# Altium schematic sheet STM32.SchDoc
size A3 portrait; Organization: Altium Limited; Address1: L3, 12a Rodborough Rd; Address2: Frenchs Forest; Address3: NSW; Address4: Australia 2086
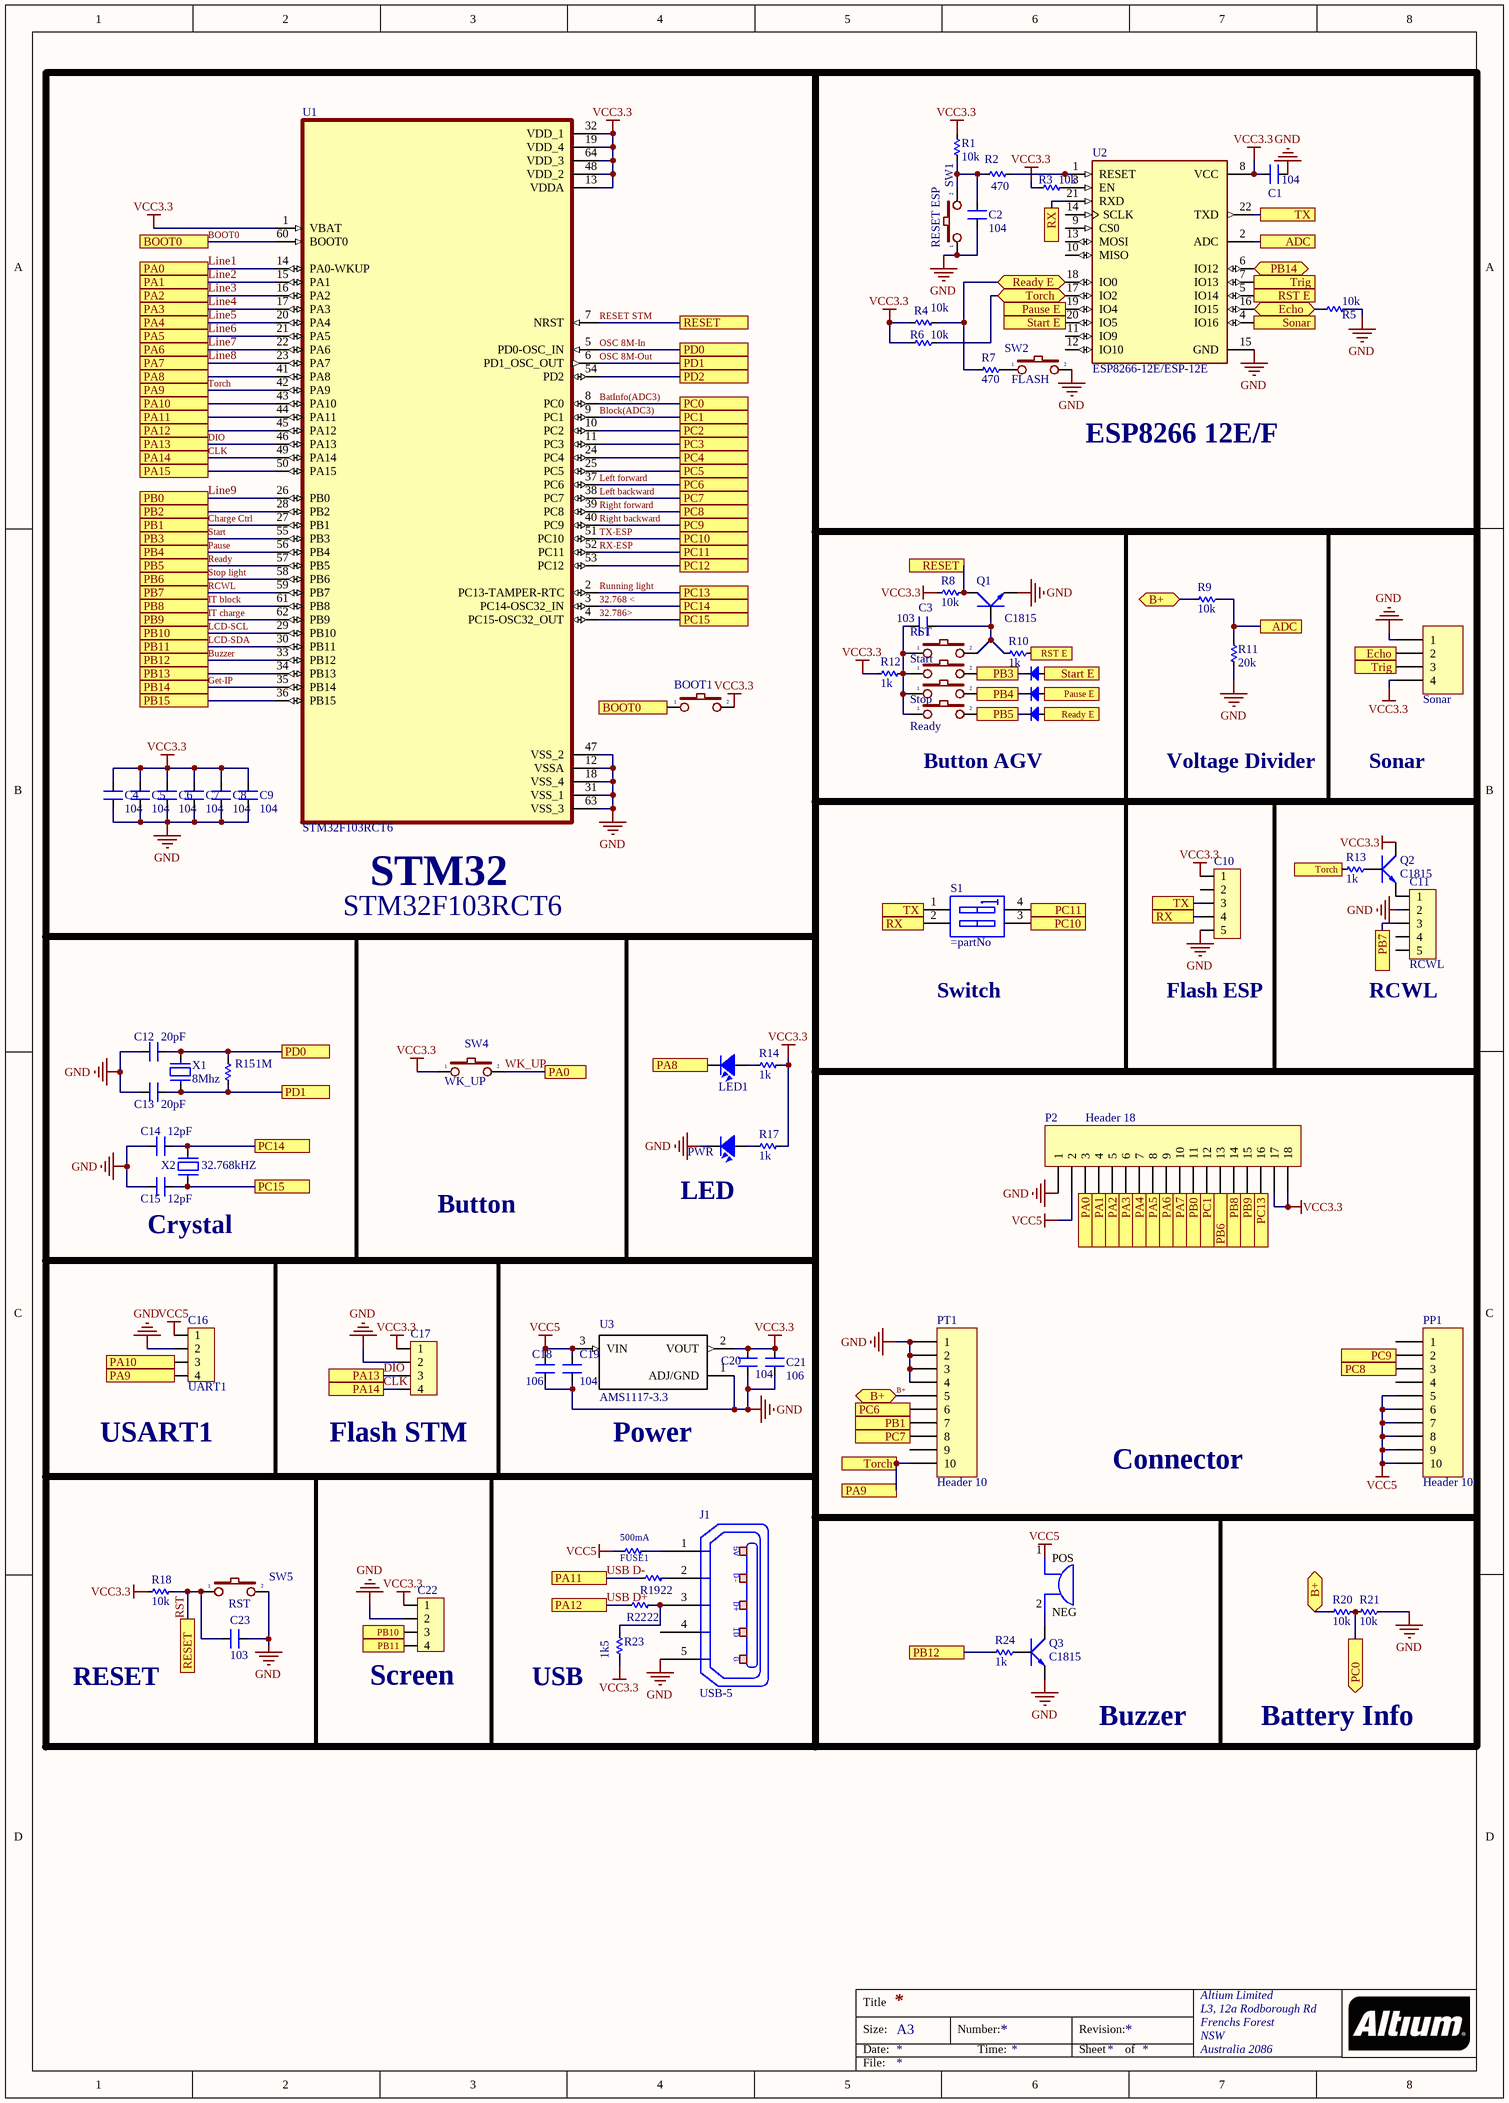
[diagram p0: STM32.SchDoc]

## Parts
BOOT1  SW  [SW-DIP1-1]  (value not drawn)
C1  104  [SM-CAP-0805]
C2  104  [SM-CAP-0805]
C3  103  [SM-CAP-0805]
C4  104  [SM-CAP-0805]
C5  104  [SM-CAP-0805]
C6  104  [SM-CAP-0805]
C7  104  [SM-CAP-0805]
C8  104  [SM-CAP-0805]
C9  104  [SM-CAP-0805]
C10  Flash ESP  [HDR5]
C11  RCWL  [HDR5]
C12  20pF  [SM-CAP-0805]
C13  20pF  [SM-CAP-0805]
C14  12pF  [SM-CAP-0805]
C15  12pF  [SM-CAP-0805]
C16  UART1  [HDR4]
C17  Flash STM  [HDR4]
C18  106  [SM-CAP-0805]
C19  104  [SM-CAP-0805]
C20  104  [SM-CAP-0805]
C21  106  [SM-CAP-0805]
C22  Screen  [HDR4]
C23  103  [SM-CAP-0805]
DIO1  Diode SMD  [DIO-SMD-106]  (value not drawn)
DIO2  Diode SMD  [DIO-SMD-106]  (value not drawn)
DIO3  Diode SMD  [DIO-SMD-106]  (value not drawn)
FUSE1  500mA  [RES-SMD-0805]
J1  USB-5  [USB-M1]
LED1  DS0  [LED-0805-Blue]  (value not drawn)
LED3  PWR  [LED-0805-Blue]
LS1  MCKPM-G1201A-K4037  [XDCR_MCKPM-G1201A-K4037]  (value not drawn)
P1  Sonar  [HDR1X4]
P2  Header 18  [HDR1X18]
PP1  Header 10  [HDR1X10]
PT1  Header 10  [HDR1X10]
Q1  C1815  [SOT23B]
Q2  C1815  [SOT23B]
Q3  C1815  [SOT23B]
R1  10k  [RES-SMD-0805]
R2  470  [RES-SMD-0805]
R3  10k  [RES-SMD-0805]
R4  10k  [RES-SMD-0805]
R5  10k  [RES-SMD-0805]
R6  10k  [RES-SMD-0805]
R7  470  [RES-SMD-0805]
R8  10k  [RES-SMD-0805]
R9  10k  [RES-SMD-0805]
R10  1k  [RES-SMD-0805]
R11  20k  [RES-SMD-0805]
R12  1k  [RES-SMD-0805]
R13  1k  [RES-SMD-0805]
R14  1k  [RES-SMD-0805]
R15  1M  [RES-SMD-0805]
R17  1k  [RES-SMD-0805]
R18  10k  [RES-SMD-0805]
R19  22  [RES-SMD-0805]
R20  10k  [RES-SMD-0805]
R21  10k  [RES-SMD-0805]
R22  22  [RES-SMD-0805]
R23  1k5  [RES-SMD-0805]
R24  1k  [RES-SMD-0805]
RST1  RST  [SW1-SMD]
S1  (no value)  [SW-DIP2]
Start1  Start  [SW1-SMD]
Stop1  Stop  [SW1-SMD]
SW1  RESET ESP  [SW1-SMD]
SW2  FLASH  [SW1-SMD]
SW3  Ready  [SW1-SMD]
SW4  WK_UP  [SW1-SMD]
SW5  RST  [SW1-SMD]
U1  STM32F103RCT6  [QFP50P1200X1200X160-64N]
U2  ESP8266-12E/ESP-12E  [XCVR_ESP8266-12E/ESP-12E]
U3  AMS1117-3.3  [*SOT229P700X180-4N]
X1  8Mhz  [XT2]
X2  32.768kHZ  [XT32k]

## Ports
ADC, B+ (bidir), BOOT0, Echo, Echo (bidir), PA0, PA0 (out), PA1, PA1 (out), PA2, PA2 (out), PA3, PA3 (out), PA4, PA4 (out), PA5, PA5 (out), PA6, PA6 (out), PA7, PA7 (out), PA8, PA9, PA10, PA11, PA12, PA13, PA14, PA15, Pause E, PB0, PB0 (out), PB1, PB1 (in), PB2, PB3, PB4, PB5, PB6, PB6 (in), PB7, PB8, PB8 (out), PB9, PB9 (out), PB10, PB11, PB12, PB13, PB14, PB14 (bidir), PB15, PC0, PC0 (out), PC1, PC2, PC3, PC4, PC5, PC6, PC7, PC8, PC9, PC10, PC11, PC12, PC13, PC13 (in), PC14, PC15, PD0, PD1, PD2, Ready E, Ready E (bidir), RESET, RST E, RX, Sonar, Start E, Torch, Torch (bidir), Torch (in), Trig, TX

## Nets
GND: C1.1 C2.1 C4.1 C5.1 C6.1 C7.1 C8.1 C9.1 C10.5 C11.2 C12.1 C13.1 C14.1 C15.1 C16.2 C17.2 C18.1 C19.1 C20.1 C21.1 C22.2 C23.1 J1.5(P5) LED3.2 P1.1 P2.1 PT1.1 PT1.2 PT1.3 PT1.4 Q1.1(E) Q3.1(E) R5.2 R11.2 R21.1 SW1.1 SW2.2 SW5.2 U1.12(VSSA) U1.18(VSS_4) U1.31(VSS_1) U1.47(VSS_2) U1.63(VSS_3) U2.15(GND) U3.1(ADJ/GND)
VCC3.3: BOOT1.2 C1.2 C4.2 C5.2 C6.2 C7.2 C8.2 C9.2 C10.1 C17.1 C20.2 C21.2 C22.1 P1.4 P2.17 P2.18 Q2.2(C) R1.1 R3.1 R4.1 R6.1 R8.1 R12.2 R14.1 R17.1 R18.2 R23.1 SW4.1 U1.1(VBAT) U1.13(VDDA) U1.19(VDD_4) U1.32(VDD_1) U1.48(VDD_2) U1.64(VDD_3) U2.8(VCC) U3.2(VOUT)
VCC5: C16.1 C18.2 C19.2 FUSE1.1 LS1.1(POS) P2.2 PP1.5 PP1.6 PP1.7 PP1.8 PP1.9 PP1.10 U3.3(VIN)
32.768 <: C14.2 U1.3(PC14-OSC32_IN) X2.2 ; port PC14
32.786>: C15.2 U1.4(PC15-OSC32_OUT) X2.1 ; port PC15
ADC: R9.2 R11.1 U2.2(ADC) ; port ADC
B+: PT1.5 R9.1 R20.2 ; port B+
BatInfo(ADC3): R20.1 R21.2 U1.8(PC0) ; port PC0
Block(ADC3): P2.12 U1.9(PC1) ; port PC1
BOOT0: BOOT1.1 U1.60(BOOT0) ; port BOOT0
Buzzer: R24.2 U1.33(PB12) ; port PB12
Charge Ctrl: PT1.7 U1.27(PB1) ; port PB1
CLK: C17.4 U1.49(PA14) ; port PA14
DIO: C17.3 U1.46(PA13) ; port PA13
Echo: P1.2 R5.1 U2.16(IO15) ; port Echo
Get-IP: U1.35(PB14) U2.6(IO12) ; port PB14
IT block: P2.14 U1.61(PB8) ; port PB8
IT charge: P2.15 U1.62(PB9) ; port PB9
LCD-SCL: C22.3 U1.29(PB10) ; port PB10
LCD-SDA: C22.4 U1.30(PB11) ; port PB11
Left backward: PT1.8 U1.38(PC7) ; port PC7
Left forward: PT1.6 U1.37(PC6) ; port PC6
Line1: P2.3 SW4.2 U1.14(PA0-WKUP) ; port PA0  [also labelled WK_UP]
Line2: P2.4 U1.15(PA1) ; port PA1
Line3: P2.5 U1.16(PA2) ; port PA2
Line4: P2.6 U1.17(PA3) ; port PA3
Line5: P2.7 U1.20(PA4) ; port PA4
Line6: P2.8 U1.21(PA5) ; port PA5
Line7: P2.9 U1.22(PA6) ; port PA6
Line8: P2.10 U1.23(PA7) ; port PA7
Line9: P2.11 U1.26(PB0) ; port PB0
OSC 8M-In: C12.2 R15.1 U1.5(PD0-OSC_IN) X1.1 ; port PD0
OSC 8M-Out: C13.2 R15.2 U1.6(PD1_OSC_OUT) X1.2 ; port PD1
PA8: LED1.2 U1.41(PA8) ; port PA8
PA10: C16.3 U1.43(PA10) ; port PA10
PA15: U1.50(PA15) ; port PA15
Pause: DIO2.2(K) Stop1.2 U1.56(PB4) ; port PB4
Pause E: DIO2.1(A) U2.19(IO4) ; port Pause E
PB2: U1.28(PB2) ; port PB2
PB13: U1.34(PB13) ; port PB13
PB15: U1.36(PB15) ; port PB15
PC2: U1.10(PC2) ; port PC2
PC3: U1.11(PC3) ; port PC3
PC4: U1.24(PC4) ; port PC4
PC5: U1.25(PC5) ; port PC5
PC12: U1.53(PC12) ; port PC12
PD2: U1.54(PD2) ; port PD2
RCWL: C11.3 U1.59(PB7) ; port PB7
Ready: DIO3.2(K) SW3.2 U1.57(PB5) ; port PB5
Ready E: DIO3.1(A) R4.2 R7.2 U2.18(IO0) ; port Ready E
RESET STM: C23.2 Q1.2(C) R8.2 R18.1 SW5.1 U1.7(NRST) ; port RESET  [also labelled RST]
Right backward: PP1.2 U1.40(PC9) ; port PC9
Right forward: PP1.3 U1.39(PC8) ; port PC8
RST E: R10.1 U2.5(IO14) ; port RST E
Running light: P2.16 U1.2(PC13-TAMPER-RTC) ; port PC13
RX: C10.4 S1.2 U2.21(RXD) ; port RX
RX-ESP: S1.4 U1.52(PC11) ; port PC11
Sonar: U2.4(IO16) ; port Sonar
Start: DIO1.2(K) Start1.2 U1.55(PB3) ; port PB3
Start E: DIO1.1(A) U2.20(IO5) ; port Start E
Stop light: P2.13 U1.58(PB6) ; port PB6
Torch: C16.4 PT1.10 R6.2 R13.1 U1.42(PA9) U2.17(IO2) ; port PA9, port Torch
Trig: P1.3 U2.7(IO13) ; port Trig
TX: C10.3 S1.1 U2.22(TXD) ; port TX
TX-ESP: S1.3 U1.51(PC10) ; port PC10
USB D+: R22.1 U1.45(PA12) ; port PA12
USB D-: R19.1 U1.44(PA11) ; port PA11
NetC2_2: C2.2 R1.2 R2.2 SW1.2
NetC3_1: C3.1 Q1.3(B) R10.2 RST1.2
NetC3_2: C3.2 R12.1 RST1.1 Start1.1 Stop1.1 SW3.1
NetC11_1: C11.1 Q2.1(E)
NetFUSE1_2: FUSE1.2 J1.1(P1)
NetJ1_2: J1.2(P2) R19.2
NetJ1_3: J1.3(P3) R22.2 R23.2
NetLED1_1: LED1.1 R14.2
NetLED3_1: LED3.1 R17.2
NetLS1_2: LS1.2(NEG) Q3.2(C)
NetQ2_3: Q2.3(B) R13.2
NetQ3_3: Q3.3(B) R24.1
NetR2_1: R2.1 U2.1(RESET)
NetR3_2: R3.2 U2.3(EN)
NetR7_1: R7.1 SW2.1

Not connected (* = marked no-connect by the designer): C10 2; C11 4 5; J1 4(P4); PP1 1 4; PT1 9; U2 9(CS0) 10(MISO) 11(IO9) 12(IO10) 13(MOSI) 14(SCLK)

## Notes on the sheet
- ESP8266 12E/F
- Button AGV
- Voltage Divider
- Sonar
- (near U1) STM32
- STM32F103RCT6
- Switch
- (near C11) RCWL
- Crystal
- Button
- LED
- (near C16) USART1
- Power
- Connector
- RESET
- (near R23) USB
- Buzzer
- Battery Info
- Title
- Size:
- Date:
- A3
- Number:
- Time:
- Revision:
- Sheet
- of
- File:
- (in symbol USB-5) 5V; D-; D+; ID; G

## Library data of the parts
BOOT1 RST1 Start1 Stop1 SW1-SW5 = SW2: Switch button 2 pin; Value: SW chip 2 pin
C1-C9 C12-C15 C18-C21 C23 = CN: Value: 0,1uF/300V; Designed by: VanDungEvn
C10 C11 = Header5: Header IDC, 5 x 1 Pin Vertical 2.54mm Pitch (Non-Boxed, Male); Manufacturer: W¨¹rth Elektronik eiSos GmbH; partNo: 613002143121; ComponentLink1 Description: Manufacturer; ComponentLink2 Description: Datasheet; NoPins: 02; Created Date: 29 March 2013; ComponentLink1URL: http://www.we-online.com; ComponentLink2URL: http://katalog.we-online.de/em/datasheet/6130xx143121.pdf; Created by: Karrer Zheng
C16 C17 C22 = Header4: Header IDC, 4 x 1 Pin Vertical 2.54mm Pitch (Non-Boxed, Male); Manufacturer: W¨¹rth Elektronik eiSos GmbH; partNo: 613002143121; ComponentLink1 Description: Manufacturer; ComponentLink2 Description: Datasheet; NoPins: 02; Created Date: 29 March 2013; ComponentLink1URL: http://www.we-online.com; ComponentLink2URL: http://katalog.we-online.de/em/datasheet/6130xx143121.pdf; Created by: Karrer Zheng
DIO1-DIO3 = Diode SMD: Default Diode; Code - JEDEC: DO-214-AB; Value: 1N5007; Published: 8-Jun-2000; Revision: July-2002: Re-released for DXP Platform.; Publisher: Altium Limited
FUSE1 R1-R15 R17-R24 = Res-SMD: Resistor; Manufacturer: Generic Components; Class: Passive; Published: 08/06/2000; Publisher: Altium Hobart Technology Centre
J1 = USB-5: Manufacturer: FCI; Manufacturer Part Number: 10118193-0001LF; Connector Type: USB - micro B; Number of Contacts: 5; Gender: Receptacle; Specifications: USB 2.0; .Creator: MM; .Checked PCB: RF; Supplier 1: Digi-Key; RoHS: RoHS Compliant; Category: Connectors, Interconnects; Stock 1: 28642; Pricing 1: 1=0.46, 10=0.433, 25=0.3712, 50=0.3156, 100=0.3032, 250=0.27224, 500=0.25988 (USD); Packaging: Cut Tape (CT); Mounting Type: Surface Mount, Right Angle, Horizontal; Features: Shielded, Solder Retention; Ingress Protection: -; ComponentLink1URL: http://portal.fciconnect.com/Comergent//fci/drawing/10118193.pdf; ComponentLink1Description: http://portal.fciconnect.com/Comergent//fci/drawing/10118193.pdf; Supplier Part Number 1: 609-4616-1-ND; .Checked SCH: MM
LED1 LED3 = LED SMD: Value: LED 3 - 5 ly 2 Colour
LS1 = MCKPM-G1201A-K4037: Zumbador y transductor magnÃ©ticos; MF: Multicomp; Value: *; SnapEDA_Link: https://www.snapeda.com/parts/MCKPM-G1201A-K4037/Multicomp/view-part/231709/?ref=snap; Package: None; MP: MCKPM-G1201A-K4037; Availability: Unavailable; Price: None
P1 = Header 4: Header, 4-Pin; LatestRevisionDate: 17-Jul-2002; LatestRevisionNote: Re-released for DXP Platform.; Publisher: Altium Limited
P2 = Header 18: Header, 18-Pin; LatestRevisionDate: 17-Jul-2002; LatestRevisionNote: Re-released for DXP Platform.; Publisher: Altium Limited
PP1 PT1 = Header 10: Header, 10-Pin; LatestRevisionDate: 17-Jul-2002; LatestRevisionNote: Re-released for DXP Platform.; Publisher: Altium Limited
Q1-Q3 = C1815: NPN 600mW, ECB; Value: C1815
S1 = SWDIP2: WS-DITV 2.54 mm small compact THT flat actuator with top tape; Manufacturer: Wurth Elektronik; Part No.: 418127160902; ComponentLink1 Description: Manufacturer; ComponentLink2 Description: Datasheet; Pole: 02; Created Date: Dec.2015; ComponentLink1URL: http://www.we-online.com; ComponentLink2URL: http://katalog.we-online.de/em/datasheet/4181271609xx.pdf; Created by: Baojun Chen
U1 = STM32F103RCT6: ARMÂ® CortexÂ®-M3 STM32F1 Microcontroller IC 32-Bit 72MHz 256KB _256K x 8_ FLASH; MF: STMicroelectronics; MP: STM32F103RCT6; Price: None; Package: LQFP-64 STMicroelectronics; Availability: Unavailable; SnapEDA_Link: https://www.snapeda.com/parts/STM32F103RCT6/STMicroelectronics/view-part/44152/?ref=snap; Value: *
U2 = ESP8266-12E/ESP-12E: This WiFi module has a 32-bit MCU micro and clock speeds supporting 80 MHz or 160 MHz. Supports the RTOS and integrated Wi-Fi MAC/BB/RF/PA/LNA, and has an on-board antenna.; MF: AI-Thinker; Price: None; Package: None; Value: *; MP: ESP8266-12E/ESP-12E; Availability: Unavailable; SnapEDA_Link: https://www.snapeda.com/parts/ESP8266-12E/ESP-12E/AI-Thinker/view-part/106414/?ref=snap
U3 = AMS1117-3.3: Sot223/Pkg 1-Amp 3.3-Volt Low Drop Out Voltage Regulatator; MF: Advanced Monolithic Systems; Price: None; MP: AMS1117-3.3; SnapEDA_Link: https://www.snapeda.com/parts/AMS1117-3.3/Advanced%20Monolithic%20Systems/view-part/53450/?ref=snap; Availability: Unavailable; Package: None; Value: *
X1 = XT2: Crystal For all Crystal 2pin.; Value: 4Mhz
X2 = XT2: Crystal, 32.768 KHz, -40 to 85 degC, 3.2 x 1.5 x 0.9 mm SMD; Value: 4Mhz